# EAGLE schematic RPi_shield (EAGLE 7.7.0)
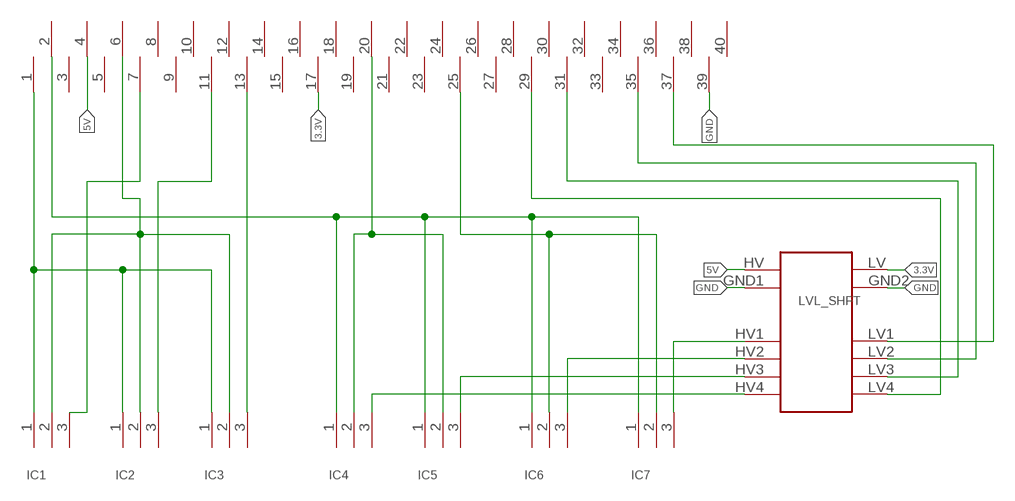
[diagram p0: schematic, sheet 1]

## Parts
IC1  3,5MM_3PIN  [3,5MM_3PIN]
IC2  3,5MM_3PIN  [3,5MM_3PIN]
IC3  3,5MM_3PIN  [3,5MM_3PIN]
IC4  3,5MM_3PIN  [3,5MM_3PIN]
IC5  3,5MM_3PIN  [3,5MM_3PIN]
IC6  3,5MM_3PIN  [3,5MM_3PIN]
IC7  3,5MM_3PIN  [3,5MM_3PIN]
IC17  40_PIN_2.54MM  [40_PIN_2.54MM]
LVL_SHFT  LVL_SHIFTER_4CH  [LVL_SHIFTER_4CH]

## Nets
3.3V: IC17.17 LVL_SHFT.LV
3.3V2: IC1.1 IC2.1 IC3.1 IC17.1
5V: IC17.4 LVL_SHFT.HV
GND: IC17.39 LVL_SHFT.GND1 LVL_SHFT.GND2
N$2: IC4.1 IC5.1 IC6.1 IC7.1 IC17.2
N$3: IC1.2 IC2.2 IC3.2 IC17.6
N$4: IC4.2 IC5.2 IC17.20
N$5: IC6.2 IC7.2 IC17.25
N$6: IC7.3 LVL_SHFT.HV1
N$7: IC6.3 LVL_SHFT.HV2
N$8: IC5.3 LVL_SHFT.HV3
N$9: IC4.3 LVL_SHFT.HV4
N$10: IC17.37 LVL_SHFT.LV1
N$11: IC17.35 LVL_SHFT.LV2
N$12: IC17.31 LVL_SHFT.LV3
N$13: IC17.29 LVL_SHFT.LV4
N$14: IC1.3 IC17.7
N$15: IC2.3 IC17.11
N$16: IC3.3 IC17.13
Unconnected: IC17.3 IC17.5 IC17.8 IC17.9 IC17.10 IC17.12 IC17.14 IC17.15 IC17.16 IC17.18 IC17.19 IC17.21 IC17.22 IC17.23 IC17.24 IC17.26 IC17.27 IC17.28 IC17.30 IC17.32 IC17.33 IC17.34 IC17.36 IC17.38 IC17.40

## Library data of the parts
IC1-IC7 = Screw_connector:3,5MM_3PIN
IC17 = 40goldpin_2_54mm:40_PIN_2.54MM
LVL_SHFT = level_shifter_MOD12:LVL_SHIFTER_4CH